# EAGLE design synth-zodiac-virgo-lfo (EAGLE 9.6.2)
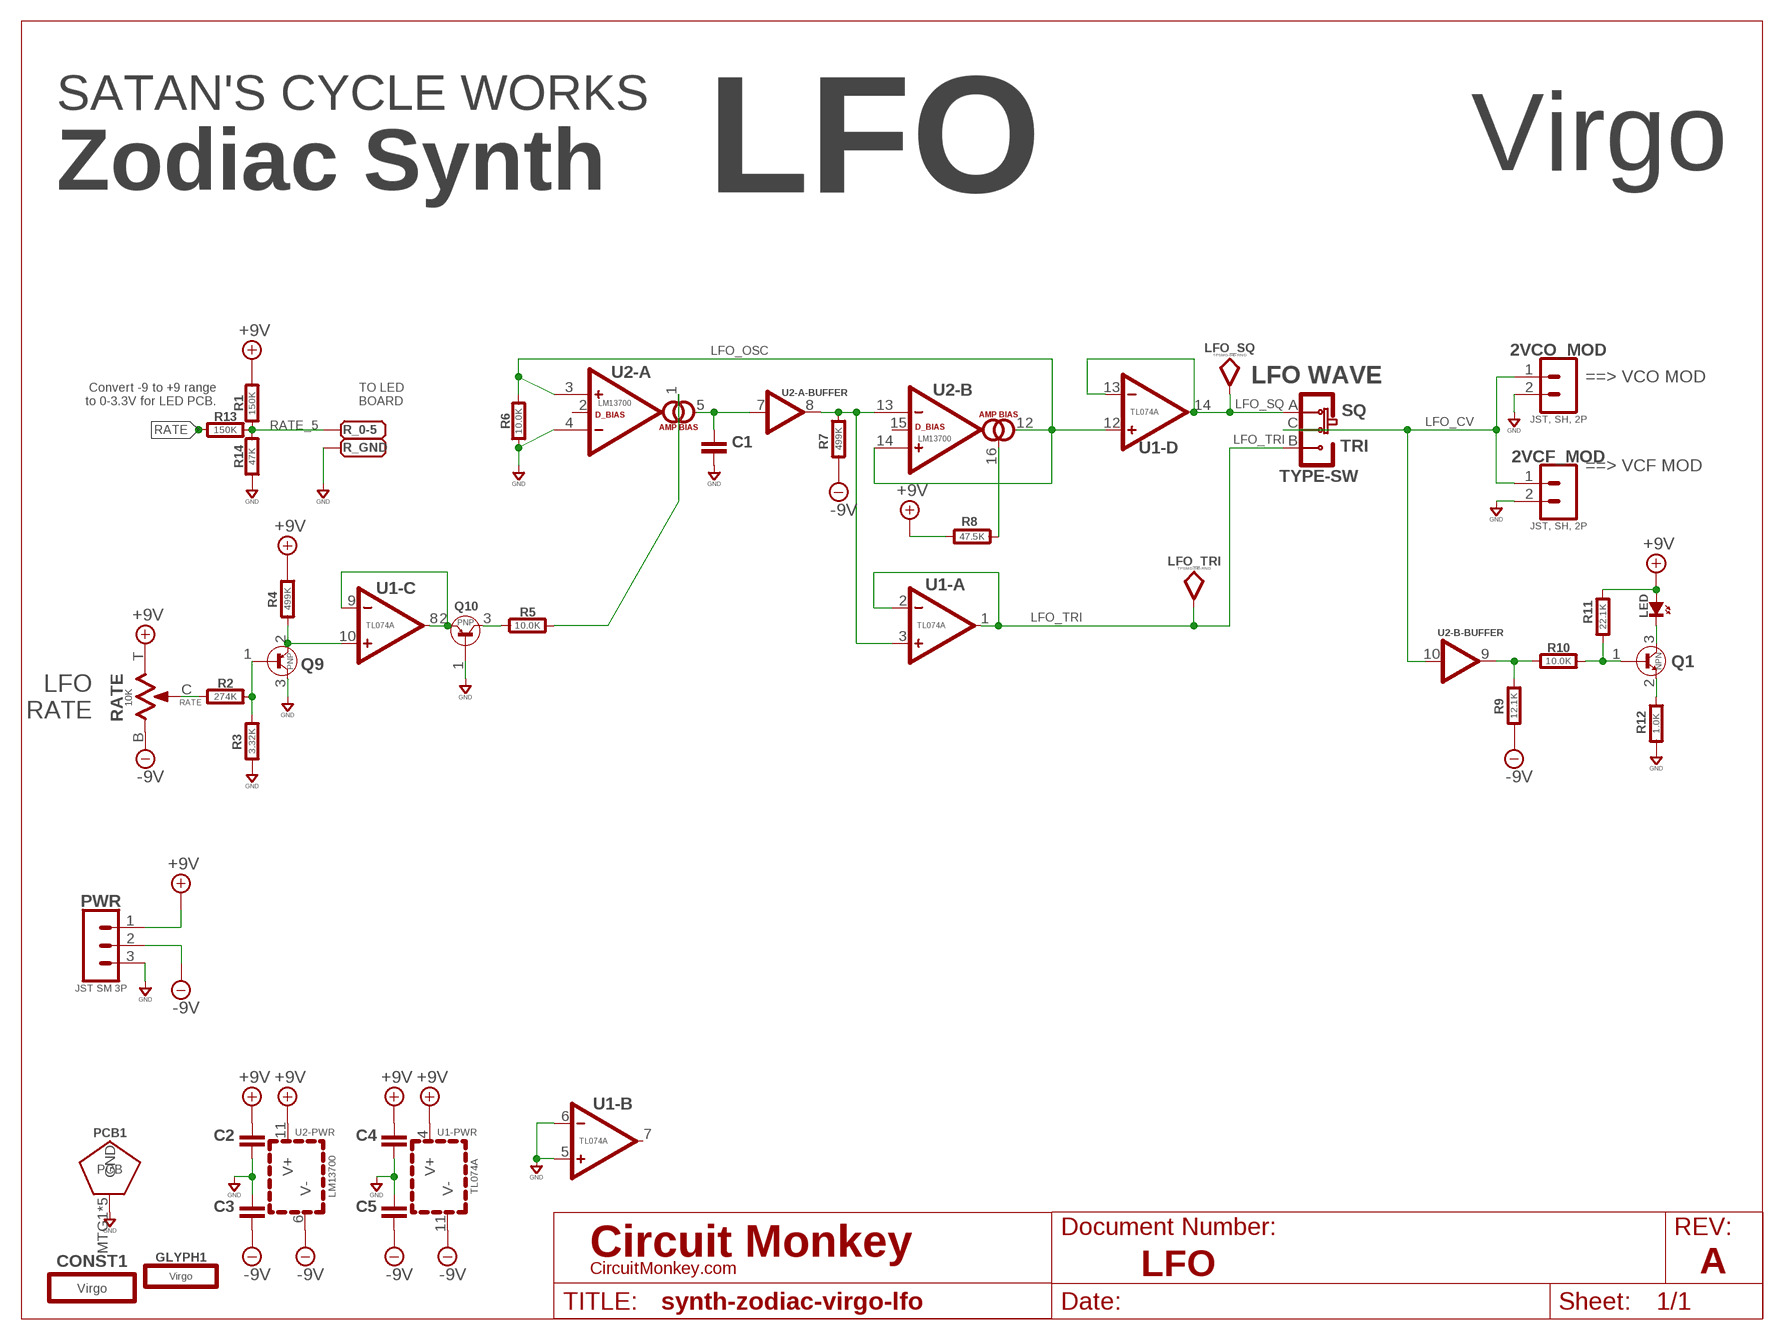
[diagram p0: schematic, sheet 1]
U$1 (LETTER_L-CIRCUITMONKEY): DOCUMENT_NUMBER: LFO; REV: A

## Parts
2VCF_MOD  JST, SH, 2P  02P-SM-VT-SMT  [BM02B-SRSS-TB]
2VCO_MOD  JST, SH, 2P  02P-SM-VT-SMT  [BM02B-SRSS-TB]
C1  0.1uF  CAPACITOR0603  [0603-CAP]
C2  0.1uF  CAPACITOR0603  [0603-CAP]
C3  0.1uF  CAPACITOR0603  [0603-CAP]
C4  0.1uF  CAPACITOR0603  [0603-CAP]
C5  0.1uF  CAPACITOR0603  [0603-CAP]
CONST1  Virgo  CONSTELLATION-VIRGO  [VIRGO-CONST]
GLYPH1  Virgo  GLYPH-VIRGO  [VIRGO-GLYPH]
LED  BLU  SMT0603  [SMD_0603]
LFO_SQ  TPSMD-040-RND  [SMD-040MIL-RND]
LFO_TRI  TPSMD-040-RND  [SMD-040MIL-RND]
PCB1  PCB FAB  PENTAGON-40R  [PENTAGON-40MM-RAD]
PWR  JST SM 3P  03P-SM-VT-SMT  [BM03B-SRSS-TB]
Q1  NPN  NPN-BC846  [SOT-23]
Q9  PNP  PNP-BC856  [SOT-23]
Q10  PNP  PNP-BC856  [SOT-23]
R1  150K  RESISTOR0603  [0603-RES]
R2  274K  RESISTOR0603  [0603-RES]
R3  3.32K  RESISTOR0603  [0603-RES]
R4  499K  RESISTOR0603  [0603-RES]
R5  10.0K  RESISTOR0603  [0603-RES]
R6  10.0K  RESISTOR0603  [0603-RES]
R7  499K  RESISTOR0603  [0603-RES]
R8  47.5K  RESISTOR0603  [0603-RES]
R9  12.1K  RESISTOR0603  [0603-RES]
R10  10.0K  RESISTOR0603  [0603-RES]
R11  22.1K  RESISTOR0603  [0603-RES]
R12  1.0K  RESISTOR0603  [0603-RES]
R13  150K  RESISTOR0603  [0603-RES]
R14  47K  RESISTOR0603  [0603-RES]
R_0-5  PADSMD-070X070  [SMD-070MIL]
R_GND  PADSMD-070X070  [SMD-070MIL]
RATE  10K  TRIMPOT9MM_PCB_SHAFT  [POT-RV9110]
TYPE  SLIDE-SPDT-MNTSS-12-F45-TH-PCB-2  [SS-12-F45-PNL-SMT-2]
U1  TL074A  QUADTL074A-SOIC  [SOP14]
U2  LM13700  DUAL-BIASLM13700-SMD  [SO16]

## Nets
+9V: C2.1 C4.1 LED.A PWR.1 R1.2 R4.1 R8.2 R11.1 RATE.T U1.4(-PWR:V+) U2.11(-PWR:V+)
-9V: C3.2 C5.2 PWR.2 R7.2 R9.2 RATE.B U1.11(-PWR:V-) U2.6(-PWR:V-)
GND: 2VCF_MOD.2 2VCO_MOD.2 C1.2 C2.2 C3.1 C4.2 C5.1 PCB1.MTG1(GND) PCB1.MTG2(GND) PCB1.MTG3(GND) PCB1.MTG4(GND) PCB1.MTG5(GND) PWR.3 Q9.3(COLLECTOR) Q10.1(BASE) R3.2 R6.1 R12.2 R14.1 R_GND.1(PAD) U1.5(-B:+) U1.6(-B:-) U2.4(-A:-)
LFO_CV: 2VCF_MOD.1 2VCO_MOD.1 TYPE.C(-SW:C) U2.10(-B-BUFFER:IN)
LFO_OSC: R6.2 U1.12(-D:+) U2.3(-A:+) U2.12(-B:OUT) U2.14(-B:+)
LFO_SQ: LFO_SQ.TP TYPE.A(-SW:A) U1.13(-D:-) U1.14(-D:OUT)
LFO_TRI: LFO_TRI.TP TYPE.B(-SW:B) U1.1(-A:OUT) U1.2(-A:-)
N$77: Q9.1(BASE) R2.2 R3.1
N$79: Q9.2(EMITTER) R4.2 U1.10(-C:+)
N$80: Q10.2(EMITTER) U1.8(-C:OUT) U1.9(-C:-)
N$81: Q10.3(COLLECTOR) R5.1
N$82: R5.2 U2.1(-A:AMP-BIAS)
N$83: C1.1 U2.5(-A:OUT) U2.7(-A-BUFFER:IN)
N$85: R7.1 U1.3(-A:+) U2.8(-A-BUFFER:OUT) U2.13(-B:-)
N$87: R8.1 U2.16(-B:AMP-BIAS)
N$88: Q1.1(BASE) R10.2 R11.2
N$89: Q1.2(EMITTER) R12.1
N$90: R9.1 R10.1 U2.9(-B-BUFFER:OUT)
N$91: LED.K(C) Q1.3(COLLECTOR)
RATE: R2.1 R13.1 RATE.C
RATE_5: R1.1 R13.2 R14.2 R_0-5.1(PAD)
Unconnected: TYPE.MTG1(-MTG:MT1) TYPE.MTG2(-MTG:MT2) TYPE.MTG3(-MTG:MT1) TYPE.MTG4(-MTG:MT2) U1.7(-B:OUT) U2.2(-A:DIODE-BIAS) U2.15(-B:DIODE-BIAS)

## Notes on the sheet
- LFO | Virgo
- SATAN'S CYCLE WORKS
- Zodiac Synth
- ==> VCO MOD
- LFO WAVE
- Convert -9 to +9 range
  to 0-3.3V for LED PCB.
- TO LED
  BOARD
- SQ
- TRI
- ==> VCF MOD
- LFO
  RATE

## Library data of the parts
2VCF_MOD 2VCO_MOD = con-jst:02P: 2 pin connector; COST01: 0.45; COST10: 0.4; COST100: 0.35; MFR: JST; MPN: BMB02B-SRSS-TB
C1-C5 = rlc:CAPACITOR: Capacitor; COST01: 0.12; COST10: 0.09; COST100: 0.05
CONST1 = circuit-monkey-zodiac:CONSTELLATION: Constellations
GLYPH1 = circuit-monkey-zodiac:GLYPH: Glyph
LED = led:SMT: LED SMT; COST01: 0.20; COST10: 0.17; COST100: 0.14
LFO_SQ LFO_TRI = con-testpoints:TP: Test Point -- Testpoint
PCB1 = circuit-monkey-zodiac:PENTAGON: Pentagram shaped PCB
PWR = con-jst:03P: 3 pin connector; COST01: 0.60; COST10: 0.45; COST100: 0.38; MFR: JST; MPN: BM03B-SRSS-TB
Q1 = transistor-bjt:NPN: NPN BJ Transistor; COST01: 0.20; COST10: 0.16; COST100: 0.10; MFR: On Semiconductor; MOUSER: https://www.mouser.com/ProductDetail/ON-Semiconductor/BC846BLT1G; MPN: BC846
Q9 Q10 = transistor-bjt:PNP: PNP BJ Transistor; MFR: On Semiconductor; MOUSER: https://www.mouser.com/ProductDetail/ON-Semiconductor/BC856BLT1G; MPN: BC856
R1-R14 = rlc:RESISTOR: Resistor; COST01: 0.10; COST10: 0.05; COST100: 0.02
R_0-5 R_GND = con-testpoints:PAD: Solder Pad
RATE = rlc:TRIMPOT: Potentiometer; COST01: 0.70; COST10: 0.60; COST100: 0.60; MFR: Tayda; MPN: RV9110NO-OS15A00; SKU: A-5517
TYPE = switch-thd:SLIDE-SPDT-MNT: Slide Switch, SPDT; COST01: 0.15; COST10: 0.12; COST100: 0.12; MFR: Tayda; MPN: A-659/A-5111/A-5104
U1 = op-amp:QUAD: Quad Op-amp; COST01: 0.95; COST10: 0.70; COST100: 0.55; MFR: ST; MPN: TL074ACDT
U2 = op-amp:DUAL-BIAS: Op Amp with Bias controls; COST01: 1.70; COST10: 1.60; COST100: 1.50; MFR: TI; MPN: LM13700M

## Board
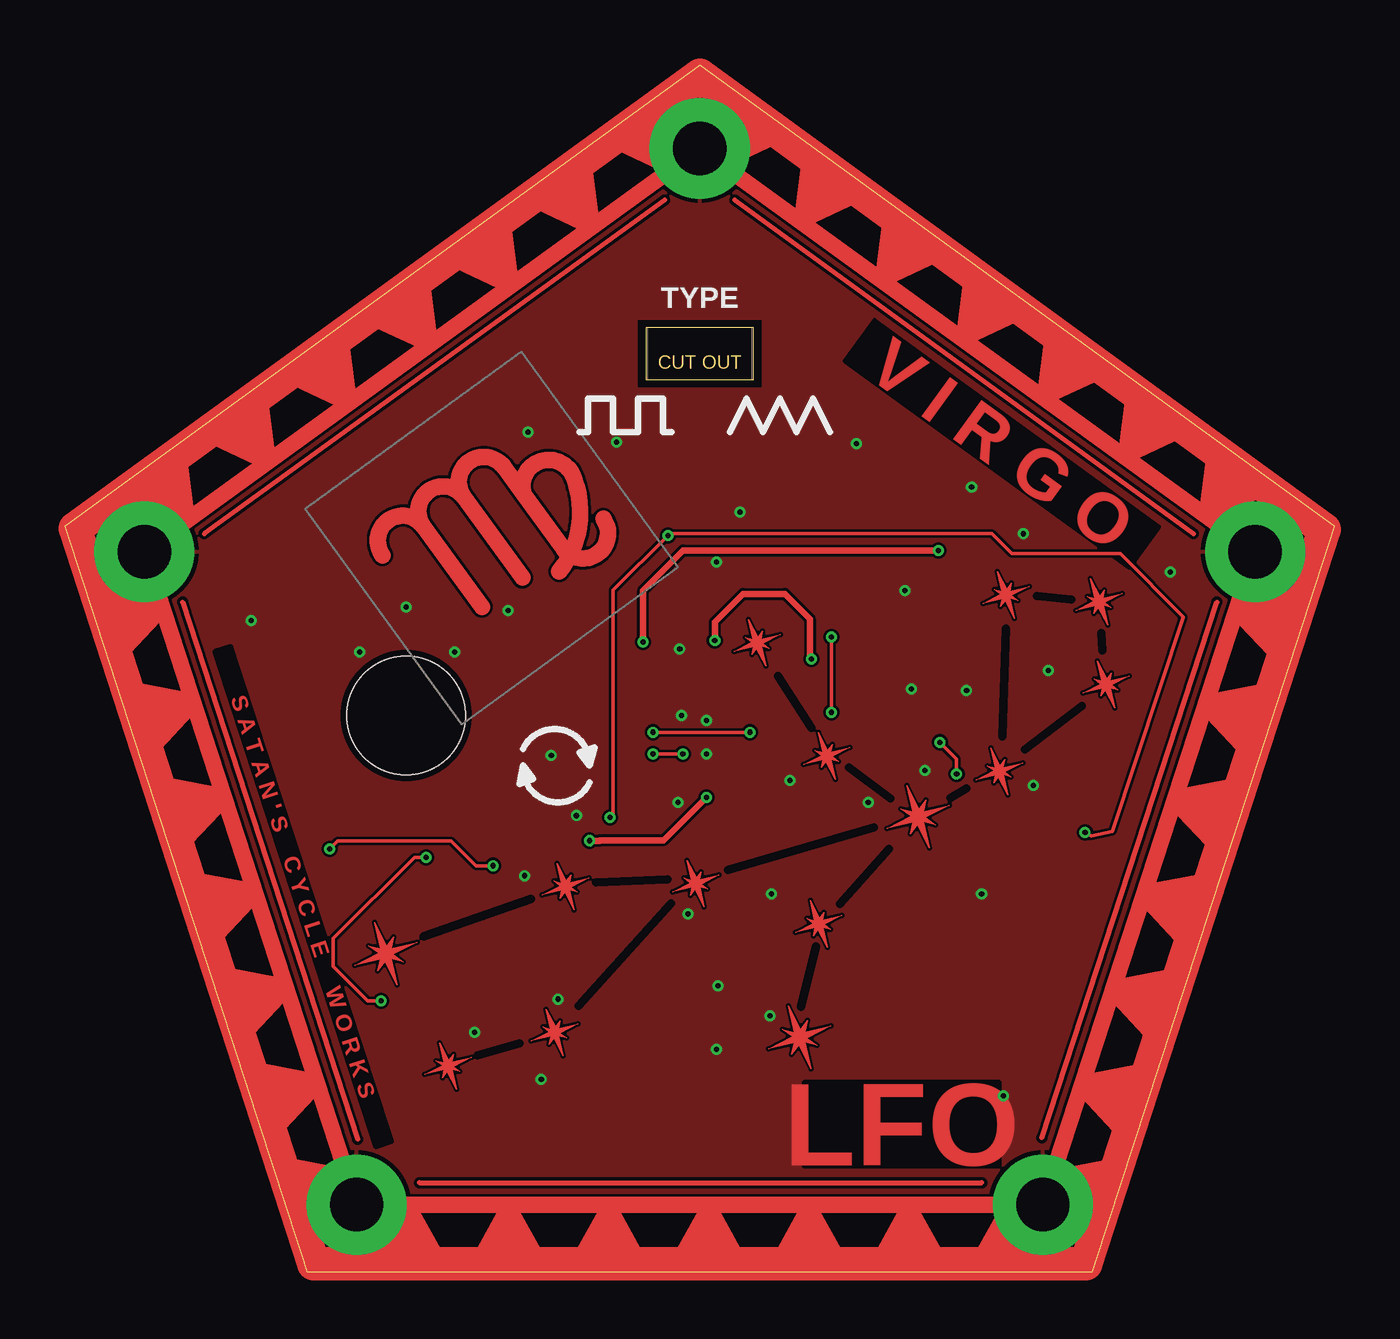
[diagram p1: board, top side]
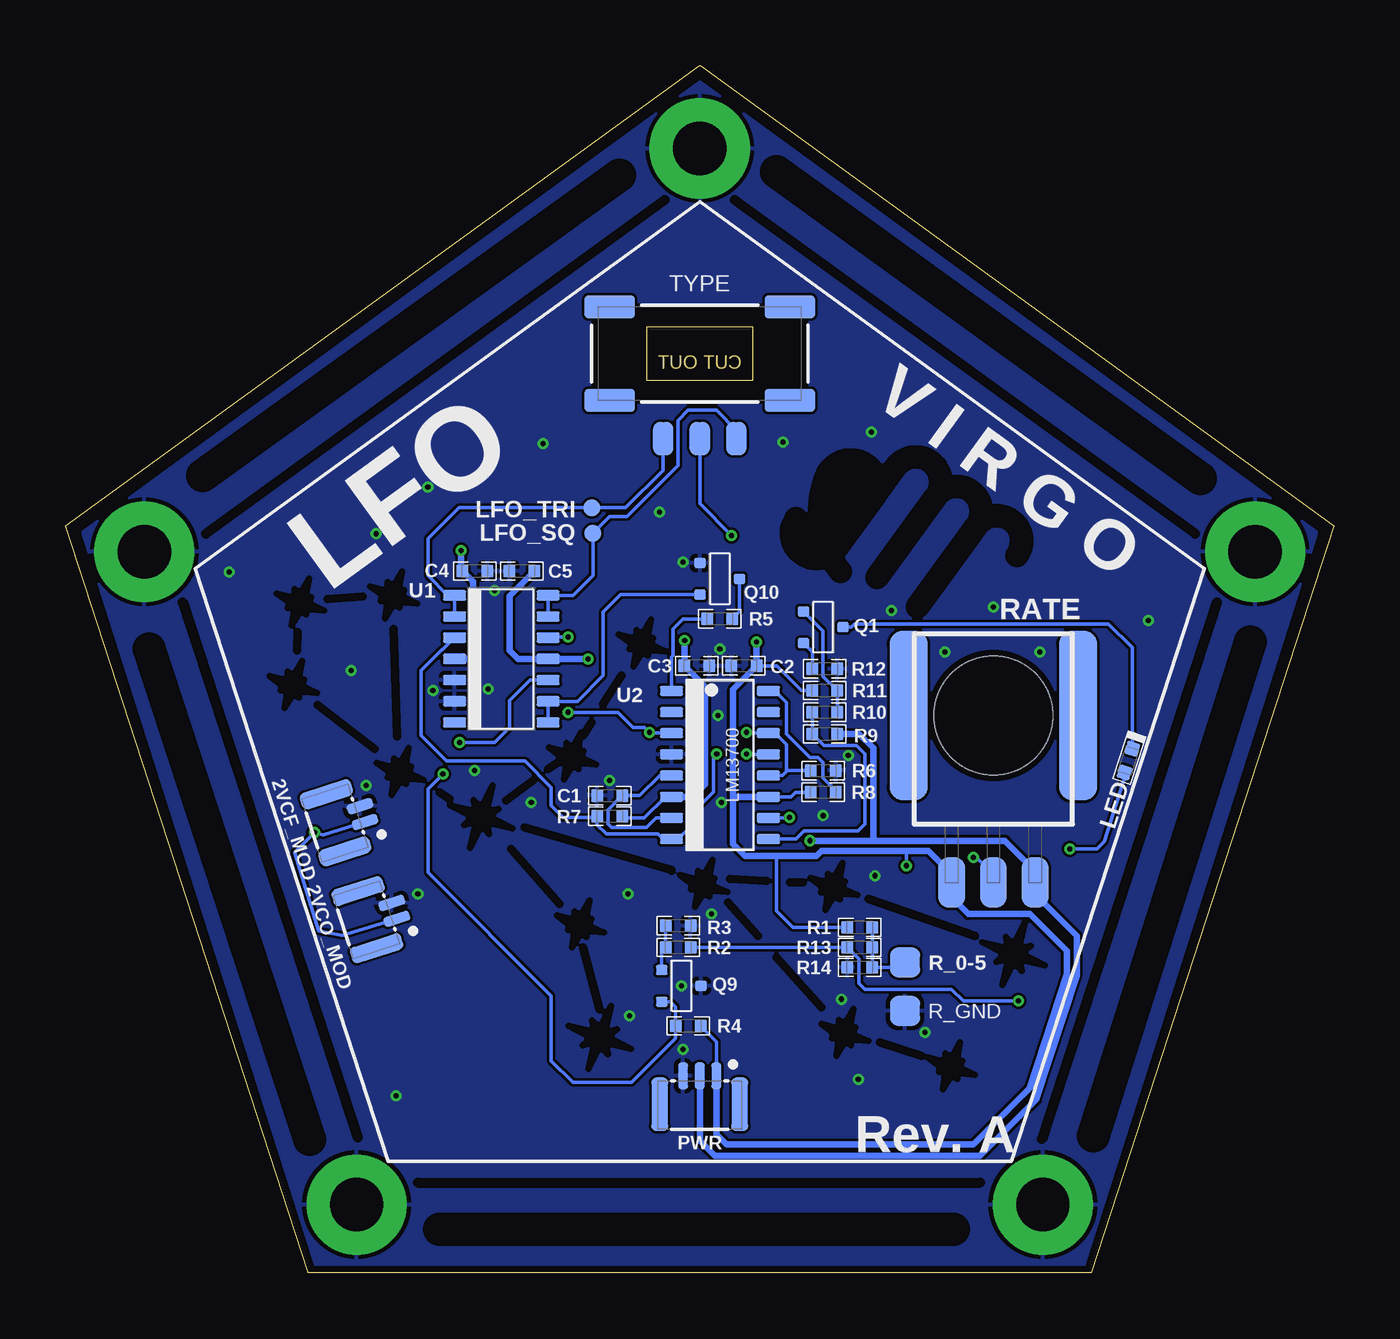
[diagram p2: board, bottom side, seen from below]

Size 76.08 x 72.36 mm. Coordinates in mm from the lower left corner, seen from the top.
Copper layers (1*16): Top 0.0356mm / dielectric 1.5011mm / Bottom 0.0356mm
Design rules "OSH-CircuitMonkey *": minimum track width 0.2mm, minimum drill 12mil, track to track 6mil, track to pad 6mil, pad to pad 6mil, via to via 6mil, smd to smd 6mil, copper to edge 15mil, drill to drill 6mil, minimum pad ring 7mil, minimum via ring 7mil, stop-mask expansion 3mil, vias tented up to drill 12mil, thermal gap 10mil
bRestrict: 19 lines

### Footprints (pad centres in the part's own frame; a part is rotated, then mirrored left to right if it is on the bottom)
BM02B-SRSS-TB = smd 0.6 x 1.6: 1 -0.5,-0.3; 2 0.5,-0.3 | smd 1 x 3.2: MTG1 1.8,1.4; MTG2 -1.8,1.4
0603-CAP = smd 0.711 x 0.762: 1 -0.752,0; 2 0.752,0
SMD_0603 = smd 0.8 x 0.8: A 0.75,0; K -0.75,0
SMD-040MIL-RND = smd 1.016 x 1.016: TP 0,0
PENTAGON-40MM-RAD = drill 3.2 pad 6: MTG1 0,35; MTG2 33.3,10.82; MTG3 20.57,-28.32; MTG4 -20.57,-28.32; MTG5 -33.3,10.82
BM03B-SRSS-TB = smd 0.6 x 1.6: 1 -1,-0.3; 2 0,-0.3; 3 1,-0.3 | smd 1 x 3.2: MTG1 2.4,1.4; MTG2 -2.4,1.4
SOT-23 = smd 0.6 x 0.7: 1 -0.95,-1.18; 2 0.95,-1.18; 3 0,1.18
0603-RES = smd 0.711 x 0.762: 1 -0.752,0; 2 0.752,0
SMD-070MIL = smd 1.778 x 1.778: 1 0.508,0
POT-RV9110 = smd 1.6 x 3: B 2.5,-10; C 0,-10; T -2.5,-10 | smd 2.286 x 10.16: MNT1 -5.08,0; MNT2 5.08,0 | hole 7.1: 0,0
SS-12-F45-PNL-SMT-2 = smd 1.2 x 2 bottom: A -2.2,-5.1; B 2.2,-5.1; C 0,-5.1 | smd 3 x 1.4 bottom: MTG1 -5.4,2.8; MTG2 5.4,2.8; MTG3 -5.4,-2.8; MTG4 5.4,-2.8
SOP14 = smd 1.4 x 0.635: 1 -2.8,3.81 | smd 1.4 x 0.63: 2 -2.8,2.54; 3 -2.8,1.27; 4 -2.8,0; 5 -2.8,-1.27; 6 -2.8,-2.54; 7 -2.8,-3.81; 8 2.8,-3.81; 9 2.8,-2.54; 10 2.8,-1.27; 11 2.8,0; 12 2.8,1.27; 13 2.8,2.54; 14 2.8,3.81
SO16 = smd 0.6 x 1.4: 1 -4.445,-2.9; 2 -3.175,-2.9; 3 -1.905,-2.9; 4 -0.635,-2.9; 5 0.635,-2.9; 6 1.905,-2.9; 7 3.175,-2.9; 8 4.445,-2.9; 9 4.445,2.9; 10 3.175,2.9; 11 1.905,2.9; 12 0.635,2.9; 13 -0.635,2.9; 14 -1.905,2.9; 15 -3.175,2.9; 16 -4.445,2.9

### Placement (x,y rotation side)
2VCF_MOD  58.54,27.36 108 bottom
2VCO_MOD  56.64,21.56 108 bottom
C1  43.44,28.56 180 bottom
C2  35.39,36.34 180 bottom
C3  38.21,36.34 180 bottom
C4  51.52,42.03 0 bottom
C5  48.7,42.03 0 bottom
CONST1  41.84,24.76 20 top
GLYPH1  25.64,44.06 36 top
LED  12.34,30.66 252 bottom
LFO_SQ  44.45,44.3 0 bottom
LFO_TRI  44.51,45.82 180 bottom
PCB1  38.04,32.36 0 top
PWR  38.04,11.46 180 bottom
Q1  30.64,38.66 270 bottom
Q9  39.14,17.16 270 bottom
Q10  36.84,41.56 270 bottom
R1  28.44,20.66 180 bottom
R2  39.34,19.46 180 bottom
R3  39.34,20.76 0 bottom
R4  38.74,14.76 180 bottom
R5  36.84,39.16 180 bottom
R6  30.64,30.06 180 bottom
R7  43.44,27.32 0 bottom
R8  30.64,28.76 180 bottom
R9  30.54,32.26 0 bottom
R10  30.54,33.56 0 bottom
R11  30.54,34.86 0 bottom
R12  30.54,36.16 0 bottom
R13  28.44,19.46 0 bottom
R14  28.44,18.26 0 bottom
R_0-5  26.24,18.56 0 bottom
R_GND  26.24,15.66 0 bottom
RATE  20.44,33.36 0 bottom
TYPE  38.04,55.06 0 top
U1  49.94,36.76 0 bottom
U2  36.83,30.4 270 bottom

### Tracks (layer width: path | path; a pad name or v marks a point on that pad's centre or on a via)
+9V  (via drill 0.3)
  Top 0.2: v25.64,24.36 24.64,24.36 23.14,25.86 16.34,25.86 v15.84,25.36
  Top 0.4: v34.64,37.76 34.64,40.86 37.04,43.26 v52.34,43.26
  Bottom 0.2: U2.11 32.56,28.5 32.3,28.76 R8.2 | C2.1 33.42,36.34 31.94,34.86 R11.1 | PWR.1 37.04,13.81 R4.1 | 33.34,24.96 33.44,24.86 33.44,21.66 32.44,20.66 R1.2 | 25.64,25.26 v25.64,24.36 | v15.84,25.36 14.24,25.36 13.8,25.81 12.52,29.79 LED.A
  Bottom 0.4: PWR.1 37.04,8.26 36.44,7.66 21.64,7.66 18.26,11.05 16.04,17.84 16.04,19.26 18.24,21.46 21.94,21.46 22.94,22.46 RATE.T 22.94,23.86 24.34,25.26 25.64,25.26 30.74,25.26 31.04,24.96 33.34,24.96 35.34,24.96 36.04,25.66 36.04,28.46 | 36.04,28.46 36.04,34.94 C2.1 v34.64,37.76 | U2.11 36.01,28.5 36.04,28.46 | U1.4 51.84,36.76 51.64,36.96 51.64,41.39 C4.1 52.34,42.09 v52.34,43.26
-9V  (via drill 0.3)
  Top 0.4: v31.44,25.86 32.04,25.86 32.06,25.88 35.86,25.88 v38.44,28.46 | v38.94,37.86 38.94,38.96 40.64,40.66 43.14,40.66 44.64,39.16 44.64,36.86 v44.74,36.76
  Bottom 0.2: R7.2 42.59,27.22 41.38,27.22 40.11,28.5 U2.6
  Bottom 0.4: PWR.2 38.04,7.86 37.14,6.96 21.24,6.96 17.88,10.32 15.44,17.8 15.44,20.16 17.94,22.66 RATE.B 17.94,24.06 19.74,25.86 27.64,25.86 | v31.44,25.86 27.64,25.86 | R9.2 28.49,32.26 27.64,31.41 27.64,25.86 | U2.6 38.48,28.5 | 38.48,28.5 v38.44,28.46 | 38.48,28.5 37.74,29.23 37.74,35.12 C3.2 38.97,37.84 v38.94,37.86 | v44.74,36.76 U1.11 48.94,36.76 49.44,37.26 49.44,40.53 C5.2
GND  (via drill 0.3)
  other vias: 30.64,27.36 27.54,23.76 20.44,39.86 11.14,39.06 29.54,16.36 28.54,11.56 42.34,22.66 42.24,15.36 56.24,10.56 54.04,34.86 66.24,41.96 54.34,47.06 47.44,49.66 40.44,45.56 33.04,49.76 26.54,39.66 27.74,50.36 57.44,44.26 48.14,28.16 58.94,36.06 39.04,13.36 39.14,17.16 24.54,14.36 37.34,21.46 54.94,22.66 58.04,29.16 29.14,30.96 36.94,33.36 39.04,42.56 50.74,34.96 38.44,31.06 38.44,33.06 36.84,37.36 50.34,40.86 51.54,30.06 23.34,37.16 17.64,37.16 43.44,29.46 36.74,28.16
  pour Bottom (rank 4): 61.04,0.36 15.04,0.36 1.04,44.36 38.04,71.36 75.04,44.36
  pour Top (rank 4): 58.64,4.06 17.44,4.06 4.64,43.16 38.04,67.26 71.34,43.26
LFO_CV  (via drill 0.3)
  Top 0.2: v32.66,27.26 32.86,27.46 32.86,40.87 v36.14,44.16 36.24,44.26 55.54,44.26 56.74,43.06 63.24,43.06 67.02,39.28 62.78,26.41 61.52,26.15 v61.14,26.36
  Bottom 0.2: U2.10 32.69,27.23 v32.66,27.26 | TYPE.C 38.04,46.06 v36.14,44.16 | 2VCF_MOD.1 58.18,26.98 58.22,26.94 60.61,26.19 v61.14,26.36 62.33,25.17 60.88,20.47 59.49,20.17 2VCO_MOD.1
LFO_OSC  (via drill 0.3)
  Top 0.2: v35.24,32.36 v41.04,32.36 | v45.94,38.06 v45.94,33.56
  Bottom 0.2: U2.12 33.09,29.77 32.79,30.06 | 32.79,30.06 32.84,30.06 32.84,31.62 33.53,32.31 U2.14 35.19,32.31 v35.24,32.36 | 32.79,30.06 R6.2 | U2.3 40.99,32.31 v41.04,32.36 41.34,32.66 42.04,32.66 42.94,33.56 v45.94,33.56 | U1.12 47.11,38.06 v45.94,38.06
LFO_SQ
  Bottom 0.2: U1.13 U1.14 45.63,40.57 44.44,41.76 LFO_SQ.TP 43.45,45.3 42.4,45.3 39.34,48.36 39.34,51.06 38.74,51.66 37.04,51.66 35.84,50.46 TYPE.A
LFO_TRI
  Bottom 0.2: U1.2 U1.1 53.15,40.57 54.34,41.76 54.34,43.96 52.48,45.82 LFO_TRI.TP 42.48,45.82 40.24,48.06 TYPE.B
N$77
  Bottom 0.2: R3.1 R2.2 40.32,19.23 Q9.1
N$79  (via drill 0.3)
  Top 0.2: v52.44,31.76 53.44,30.76 v53.44,29.86
  Bottom 0.2: U1.10 48.21,35.49 49.44,34.26 49.44,32.66 50.34,31.76 v52.44,31.76 | v53.44,29.86 54.34,28.96 54.34,23.96 46.94,16.56 46.94,12.66 45.64,11.36 42.14,11.36 39.49,14.01 R4.2 39.49,15.91 39.79,16.21 Q9.2
N$80
  Bottom 0.2: U1.8 U1.9 45.38,34.22 43.84,35.76 43.84,39.56 42.79,40.61 Q10.2
N$81
  Bottom 0.2: Q10.3 35.66,39.59 R5.1
N$82
  Bottom 0.2: R5.2 39.04,39.16 39.64,38.56 39.64,36.96 39.74,36.86 39.74,35.66 39.73,35.65 U2.1
N$83
  Bottom 0.2: U2.5 40.44,29.77 41.64,28.56 C1.1 43.54,27.71 43.54,26.86 43.34,26.66 41.23,26.66 40.67,27.23 U2.7
N$85  (via drill 0.3)
  Top 0.2: v35.24,31.06 v37.02,31.06
  Bottom 0.2: U2.13 35.22,31.04 v35.24,31.06 | v37.02,31.06 37.23,30.86 37.23,28.78 38.53,27.47 38.53,26.76 39.33,25.96 U2.8 40.23,25.96 40.53,26.26 43.64,26.26 44.19,26.81 44.19,27.21 | 44.19,27.21 R7.1 | U1.3 53.45,37.33 53.49,37.33 54.74,36.08 54.74,32.16 53.23,30.64 48.52,30.64 46.94,29.06 46.94,27.96 46.24,27.26 44.24,27.26 44.19,27.21
N$87
  Bottom 0.2: U2.16 33.53,34.85 32.84,34.16 32.84,32.26 31.44,30.86 30.94,30.86 30.64,30.56 30.64,29.61 29.89,28.86 R8.1
N$88
  Bottom 0.2: R10.2 R11.2 30.64,35.71 30.64,38.43 Q1.1
N$89
  Bottom 0.2: Q1.2 31.29,37.18 R12.1
N$90
  Bottom 0.2: R10.1 R9.1 30.59,31.56 28.64,31.56 28.14,31.06 28.14,26.86 28.56,26.44 31.78,26.44 32.27,25.96 U2.9
N$91
  Bottom 0.2: Q1.3 28.96,38.66 28.76,38.86 13.54,38.86 12.11,37.43 LED.K
RATE  (via drill 0.3)
  Top 0.2: v21.64,24.86 20.94,24.86 16.08,19.99 16.08,18.33 18.14,16.26 v18.94,16.26
  Bottom 0.2: R2.1 R13.1 28.49,18.76 28.49,17.31 28.14,16.96 22.94,16.96 22.24,16.26 v18.94,16.26 | RATE.C 20.44,23.86 21.44,24.86 v21.64,24.86
RATE_5
  Bottom 0.2: R1.1 R13.2 R14.2 26.03,18.26 R_0-5.1

### Text on the board
Top: V I R G O | S A T A N ' S C Y C L E W O R K S | LFO
bPlace: V I R G O | LFO | Rev. A
tStop: V I R G O | S A T A N ' S C Y C L E W O R K S | LFO